# Altium schematic sheet CONNECTOR.SchDoc
size A4; SheetNumber: 4; SheetTotal: 4
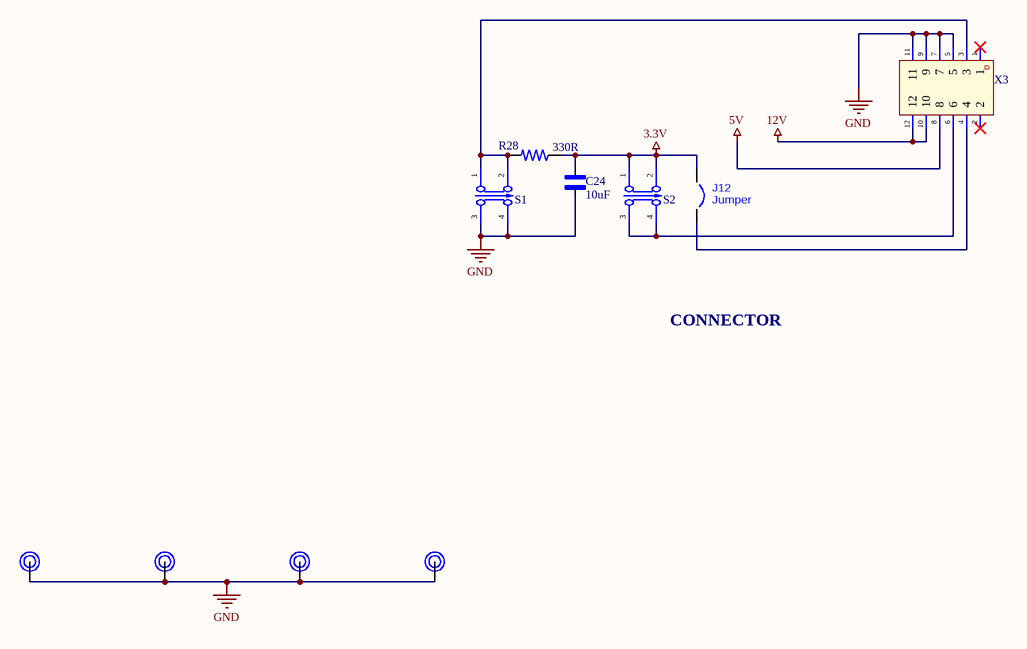
[diagram p0: CONNECTOR.SchDoc]

## Parts
C24  value 10uF  [CAP_0805]  (hidden comment: SMD capacitor)
J12  Jumper  [PAD-JUMPER-2-NC_BY_PASTE_YES_SILK]
R28  value 330R  [RES_0603]  (hidden comment: SMD resistor)
S1  THT Button  [SW-TH_BTSA-X-P-17]  (value not drawn)
S2  THT Button  [SW-TH_BTSA-X-P-17]  (value not drawn)
SCREW_1  Screw Hole  [PCB hole]  (value not drawn)
SCREW_2  Screw Hole  [PCB hole]  (value not drawn)
SCREW_3  Screw Hole  [PCB hole]  (value not drawn)
SCREW_4  Screw Hole  [PCB hole]  (value not drawn)
X3  Connector  [CONN-TH_S12B-PHDSS-B-LF-SN]  (value not drawn)

## Nets
3.3V: C24.1 J12.1 R28.1 S2.1 S2.2
5V: X3.8
12V: X3.10 X3.12
GND: C24.2 S1.3 S1.4 SCREW_1.1 SCREW_2.1 SCREW_3.1 SCREW_4.1 X3.5 X3.7 X3.9 X3.11
NetJ12_2: J12.2 X3.4
NetR28_2: R28.2 S1.1 S1.2 X3.3
NetS2_3: S2.3 S2.4 X3.6

Not connected (* = marked no-connect by the designer): X3 1* 2*

## Notes on the sheet
- CONNECTOR

## Library data of the parts
C24 = CAP_SMD_CERAMIC: Voltage: 50V; Tolerance: ±10%; Package: 0805; Price: *; JLCPCB Part #: *
J12 = JUMPER SOLDER BRIDGE: SMD JUMPER
R28 = RES_SMD_CERAMIC: Tolerance: ±5%; Package: 0603; Price: *; JLCPCB Part #: *
S1 S2 = BTSA-N-P-17: Non-Latching Through Hole 10,000 Cycles Without 2.6N 100mA Through Hole Pushbutton Switches ROHS; Manifacturing Company Name: ROCPU Switches; Manifacturing Part Number: BTSA-N-P-17; Data Sheet: https://www.lcsc.com/datasheet/C2693641.pdf; Package: THT; Price: N/A; Tolerance: N/A; JLCPCB Part #: C2693641; Value: N/A
X3 = S12B-PHDSS-B(LF)(SN): 2x6P 12P PHD Tin 2mm 6 -25℃~+85℃ 3A 2 2mm Copper Alloy Right Angle Through Hole,Right Angle,P=2mm Wire To Board Connector ROHS; Manifacturing Company Name: JST; Tolerance: ±5%; Manifacturing Part Number: S12B-PHDSS-B(LF)(SN); Data Sheet: https://www.lcsc.com/datasheet/C493114.pdf; Package: Through Hole,Right Angle,P=2mm; Price: *; JLCPCB Part #: C493114